# EasyEDA schematic SCH_Power-sequnecing.json
TITLE: POWER SEQUENCING; REV: 1.0; Date: 2025-04-19; Sheet: 1/1; Drawn By: janardhan bv
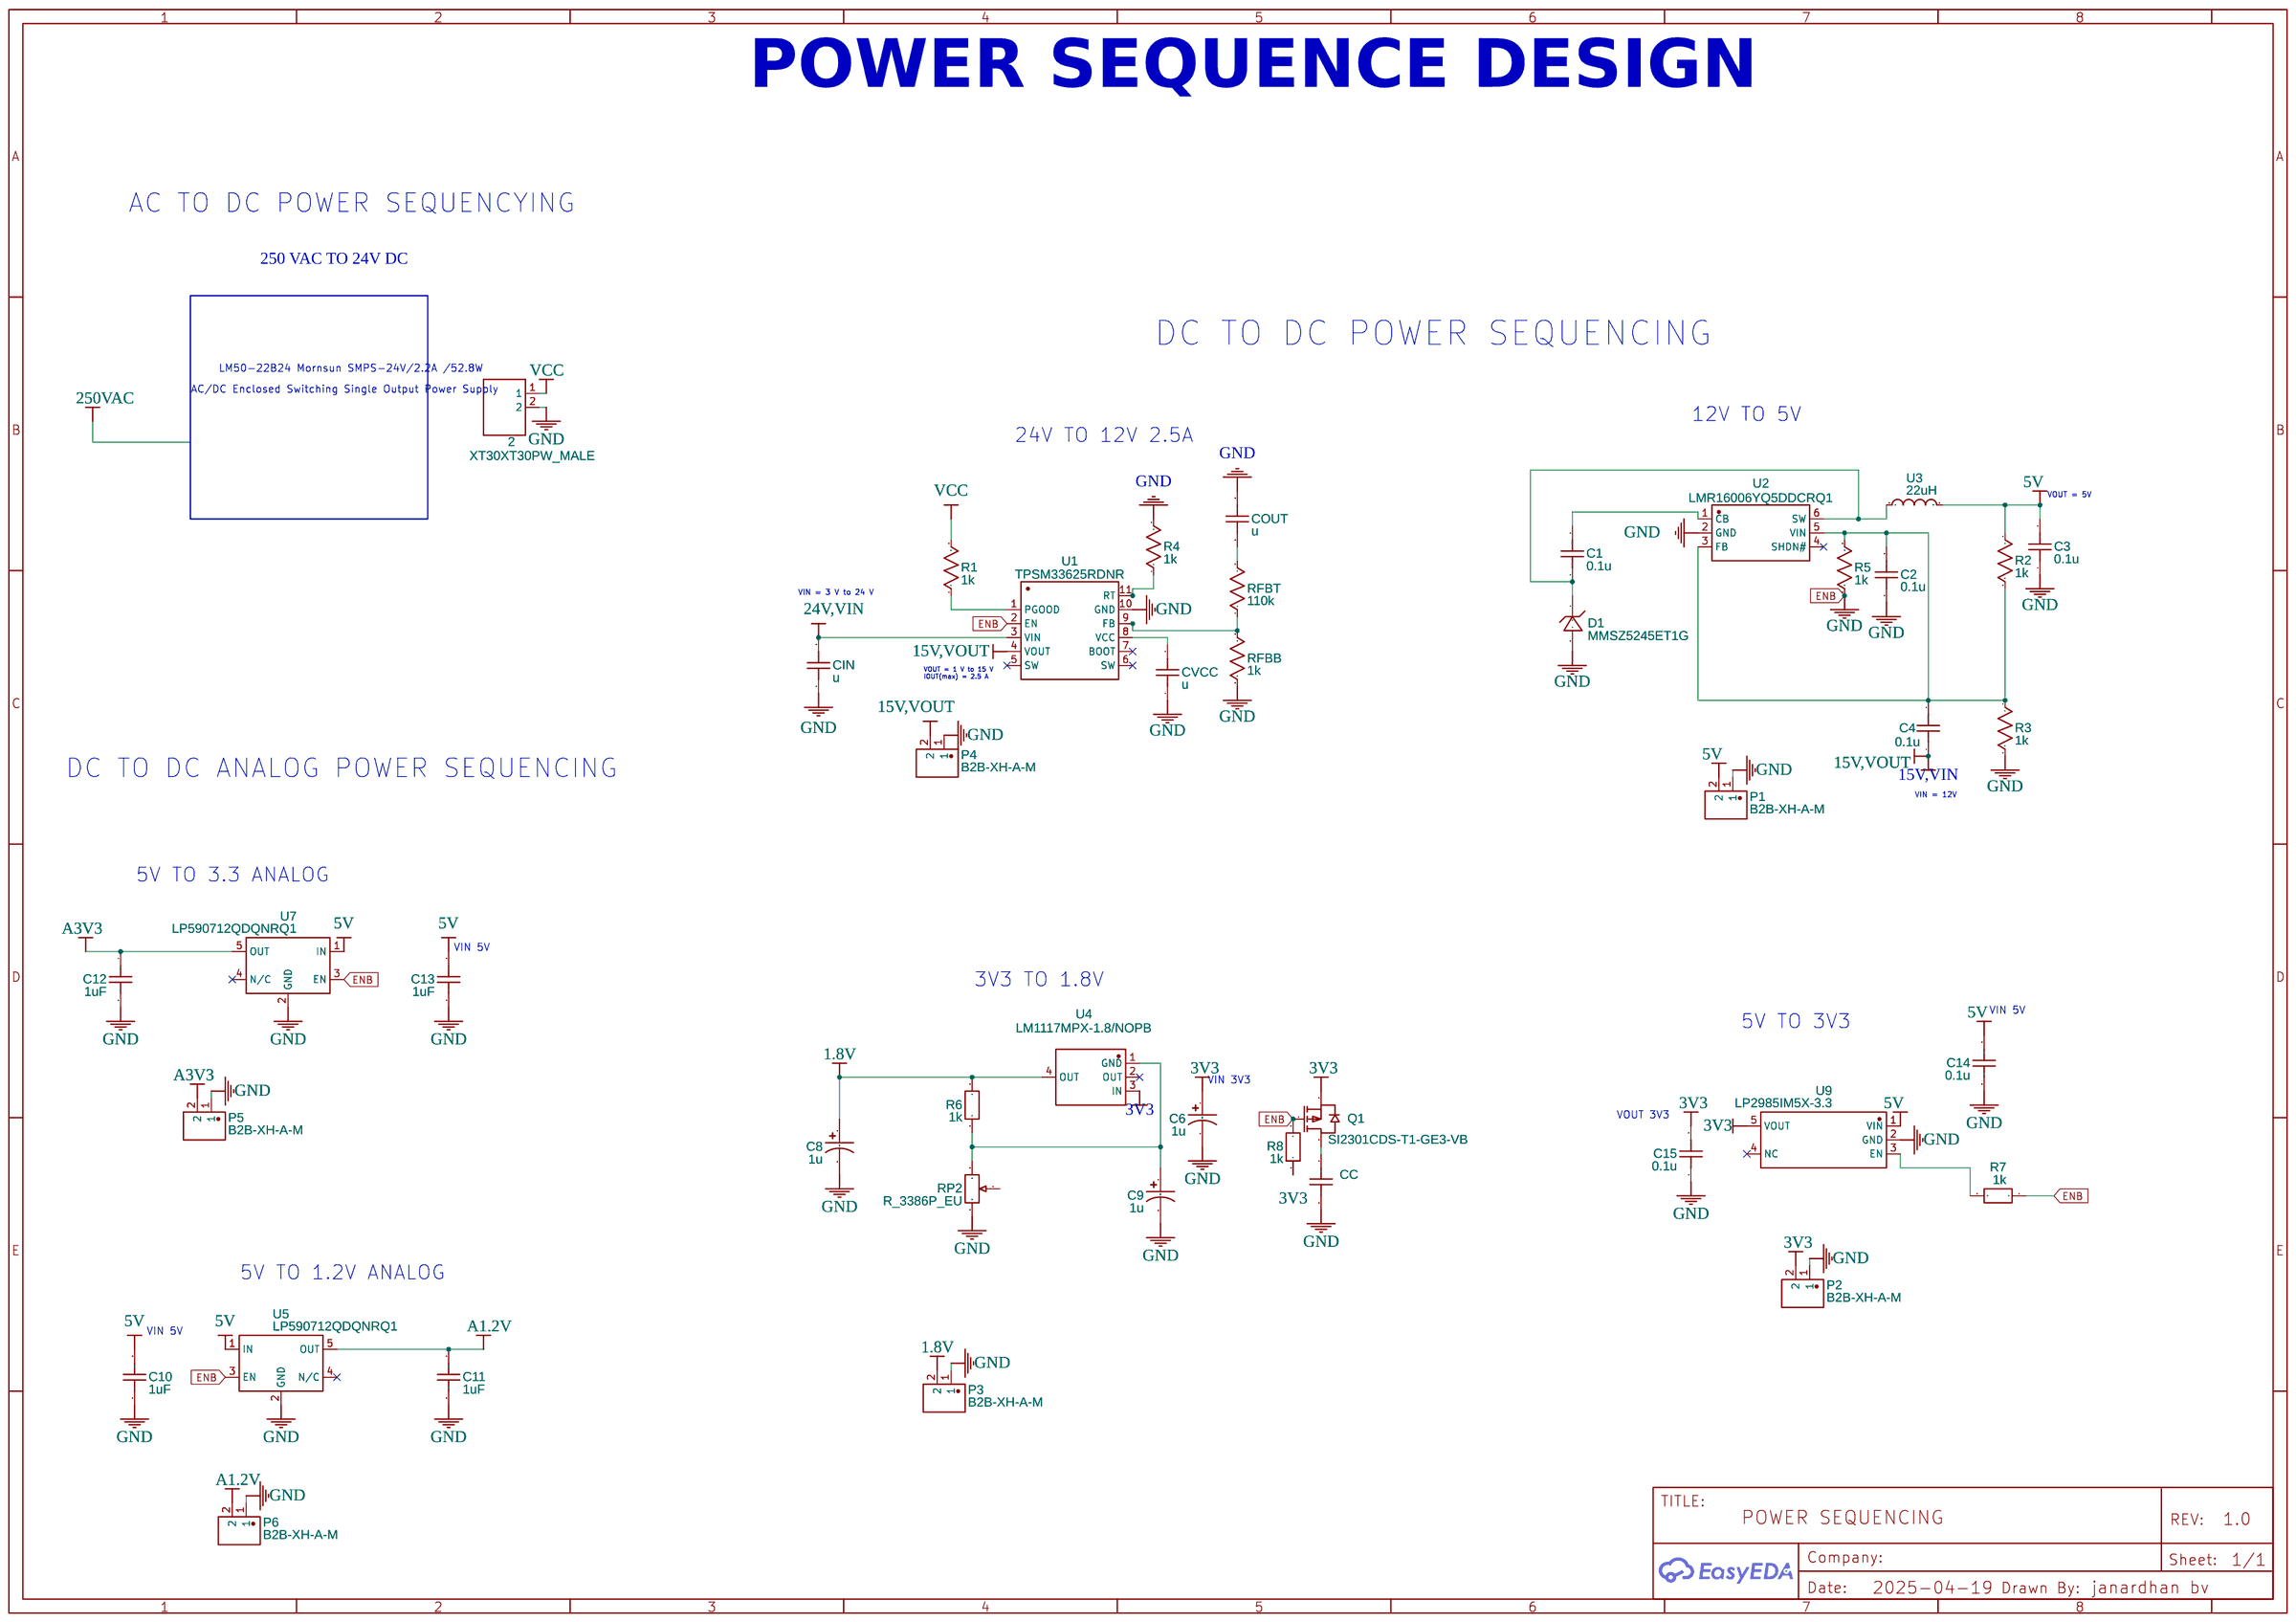
[diagram p0: schematic sheet]

## Parts
2  XT30XT30PW_MALE  [XT30PW_MALE]
C1  0.1u  [C0603]
C2  0.1u  [C0603]
C3  0.1u  [C0603]
C4  0.1u  [C0603]
C6  1u  [CASE-A_3216]
C8  1u  [CASE-A_3216]
C9  1u  [CASE-A_3216]
C10  1uF  [C0603]
C11  1uF  [C0603]
C12  1uF  [C0603]
C13  1uF  [C0603]
C14  0.1u  [C0603]
C15  0.1u  [C0603]
CC  0.1u  [C0603]
CIN  u  [C0603]
COUT  u  [C0603]
CVCC  u  [C0603]
D1  MMSZ5245ET1G  [SOD-123_L2.7-W1.6-LS3.7-RD]
P1  B2B-XH-A-M  [CONN-TH_B2B-XH-A-M]
P2  B2B-XH-A-M  [CONN-TH_B2B-XH-A-M]
P3  B2B-XH-A-M  [CONN-TH_B2B-XH-A-M]
P4  B2B-XH-A-M  [CONN-TH_B2B-XH-A-M]
P5  B2B-XH-A-M  [CONN-TH_B2B-XH-A-M]
P6  B2B-XH-A-M  [CONN-TH_B2B-XH-A-M]
Q1  SI2301CDS-T1-GE3-VB  [SOT-23-3_L2.9-W1.3-P1.90-LS2.4-BR]
R1  1k  [R0603]
R2  1k  [R0603]
R3  1k  [R0603]
R4  1k  [R0603]
R5  1k  [R0603]
R6  1k  [R0603]
R7  1k  [R0603]
R8  1k  [R0603]
RFBB  1k  [R0603]
RFBT  110k  [R0603]
RP2  R_3386P_EU  [RES-ADJ-TH_3386P]
U1  TPSM33625RDNR  [QFN-11_L4.5-W3.5-P0.50-TL_TPSM365R6FRDNR]
U2  LMR16006YQ5DDCRQ1  [TSOT-23-6_L2.9-W1.6-P0.95-LS2.8-BR]
U3  22uH  [IND-SMD_L2.1-W1.5]
U4  LM1117MPX-1.8/NOPB  [SOT-223-4_L6.5-W3.5-P2.30-LS7.0-BR]
U5  LP590712QDQNRQ1  [SOT-23-5_L3.0-W1.7-P0.95-LS2.8-BR]
U7  LP590712QDQNRQ1  [SOT-23-5_L3.0-W1.7-P0.95-LS2.8-BR]
U9  LP2985IM5X-3.3  [SOT-23-5_L2.9-W1.6-P0.95-LS2.8-BR]

## Library data of the parts
2 = XT30XT30PW_MALE: Contributor: akun pang
C1-C4 C10-C15 CC CIN COUT CVCC = C_0603_US: Contributor: LCEDA_Lib
C6 C8 C9 = C_Tan_SMD_A_US: Contributor: LCEDA_Lib
D1 = MMSZ5245ET1G: Contributor: LCSC; Supplier: LCSC; Supplier Part: C463089; Manufacturer: onsemi(安森美); JLCPCB Part Class: Extended Part
P1-P6 = B2B-XH-A-M: Contributor: LCSC; Supplier: LCSC; Supplier Part: C2683608; Manufacturer: JST; Manufacturer Part: B2B-XH-A-MB2P-VH（SMT业务专用）; JLCPCB Part Class: Extended Part
Q1 = SI2301CDS-T1-GE3-VB: Contributor: lcsc; Supplier: LCSC; Supplier Part: C5438957; Manufacturer: VBsemi(微碧半导体); JLCPCB Part Class: Extended Part
R1-R5 RFBB RFBT = R_0603_US: Contributor: LCEDA_Lib
R6-R8 = R_0603_EU: Contributor: LCEDA_Lib
RP2 = R_3386P_EU: Supplier: LCSC; Contributor: LCEDA_Lib; Value(Ω): 10K
U1 = TPSM33625RDNR: Supplier: LCSC; Supplier Part: C7073593; Manufacturer: TI(德州仪器); JLCPCB Part Class: Extended Part; Contributor: lcsc
U2 = LMR16006YQ5DDCRQ1: Contributor: lcsc; Supplier: LCSC; Supplier Part: C962072; Manufacturer: TI(德州仪器); JLCPCB Part Class: Extended Part
U3 = SNR.201610.SYB220MT00: Contributor: lcsc; Supplier: LCSC; Supplier Part: C5122815; Manufacturer: SOREDE(索瑞达); JLCPCB Part Class: Extended Part
U4 = LM1117MPX-1.8/NOPB: Contributor: LCSC; Supplier: LCSC; Supplier Part: C2877970; Manufacturer: TI(德州仪器); JLCPCB Part Class: Extended Part
U5 U7 = LP5907MFX-1.8/NOPB: Supplier: LCSC; Manufacturer: TI(德州仪器); Supplier Part: C92498; JLCPCB Part Class: Extended Part
U9 = LP2985IM5X-3.3: Contributor: lcsc; Supplier: LCSC; Supplier Part: C5380655; Manufacturer: TECH PUBLIC(台舟); JLCPCB Part Class: Extended Part

## Nets
1.8V: C8.1 P3.2 R6.2 U4.4(OUT)
3V3: C6.1 C15.2 P2.2 Q1.2(S) R8.1 U4.3(IN) U9.5(VOUT)
5V: C3.2 C10.2 C13.2 C14.1 P1.2 R2.1 U3.2 U5.1(IN) U7.1(IN) U9.1(VIN)
15V,VIN: C4.1 P4.2 U1.4(VOUT)
24V,VIN: CIN.2 U1.3(VIN)
A1.2V: C11.1 P6.2 U5.5(OUT)
A3V3: C12.1 P5.2 U7.5(OUT)
VCC: 2.1 R1.2
ENB: 2.2 C2.1 C3.1 C6.2 C8.2 C9.2 C10.1 C11.2 C12.2 C13.1 C14.2 C15.1 CC.2 CIN.1 COUT.1 CVCC.1 D1.2(A) P1.1 P2.1 P3.1 P4.1 P5.1 P6.1 Q1.1(G) R3.2 R4.2 R5.1 R7.1 R8.2 RFBB.2 RP2.1 U1.2(EN) U1.10(GND) U2.2(GND) U5.2(GND) U5.3(EN) U7.2(GND) U7.3(EN) U9.2(GND)
Net-(C1-1): C1.1 D1.1(C) U2.6(SW) U3.1
Net-(C1-2): C1.2 U2.1(CB)
Net-(C2-2): C2.2 C4.2 R2.2 R3.1 R5.2 U2.3(FB) U2.5(VIN)
Net-(C9-1): C9.1 R6.1 RP2.3 U4.1(GND)
Net-(CC-1): CC.1 Q1.3(D)
Net-(COUT-2): COUT.2 RFBT.2
Net-(CVCC-2): CVCC.2 U1.8(VCC)
Net-(R1-1): R1.1 U1.1(PGOOD)
Net-(R4-1): R4.1 U1.11(RT)
Net-(R7-2): R7.2 U9.3(EN)
Net-(RFBB-1): RFBB.1 RFBT.1 U1.9(FB)

Not connected (* = marked no-connect by the designer): RP2 2; U1 5(SW)* 6(SW)* 7(BOOT)*; U2 4(SHDN#)*; U4 2(OUT)*; U5 4(N/C)*; U7 4(N/C)*; U9 4(NC)*

## Notes on the sheet
- POWER SEQUENCE DESIGN
- AC TO DC POWER SEQUENCYING
- 250 VAC TO 24V DC
- DC TO DC POWER SEQUENCING
- LM50-22B24 Mornsun SMPS-24V/2.2A /52.8W
- AC/DC Enclosed Switching Single Output Power Supply
- 12V TO 5V
- 24V TO 12V 2.5A
- VOUT = 5V
- VIN = 3 V to 24 V
- VOUT = 1 V to 15 V
  IOUT(max) = 2.5 A
- DC TO DC ANALOG POWER SEQUENCING
- VIN = 12V
- 5V TO 3.3 ANALOG
- VIN 5V
- 3V3 TO 1.8V
- 5V TO 3V3
- VIN 5V
- VIN 3V3
- VOUT 3V3
- 5V TO 1.2V ANALOG
- VIN 5V
